# EAGLE design AlvDuino (EAGLE 6.3)
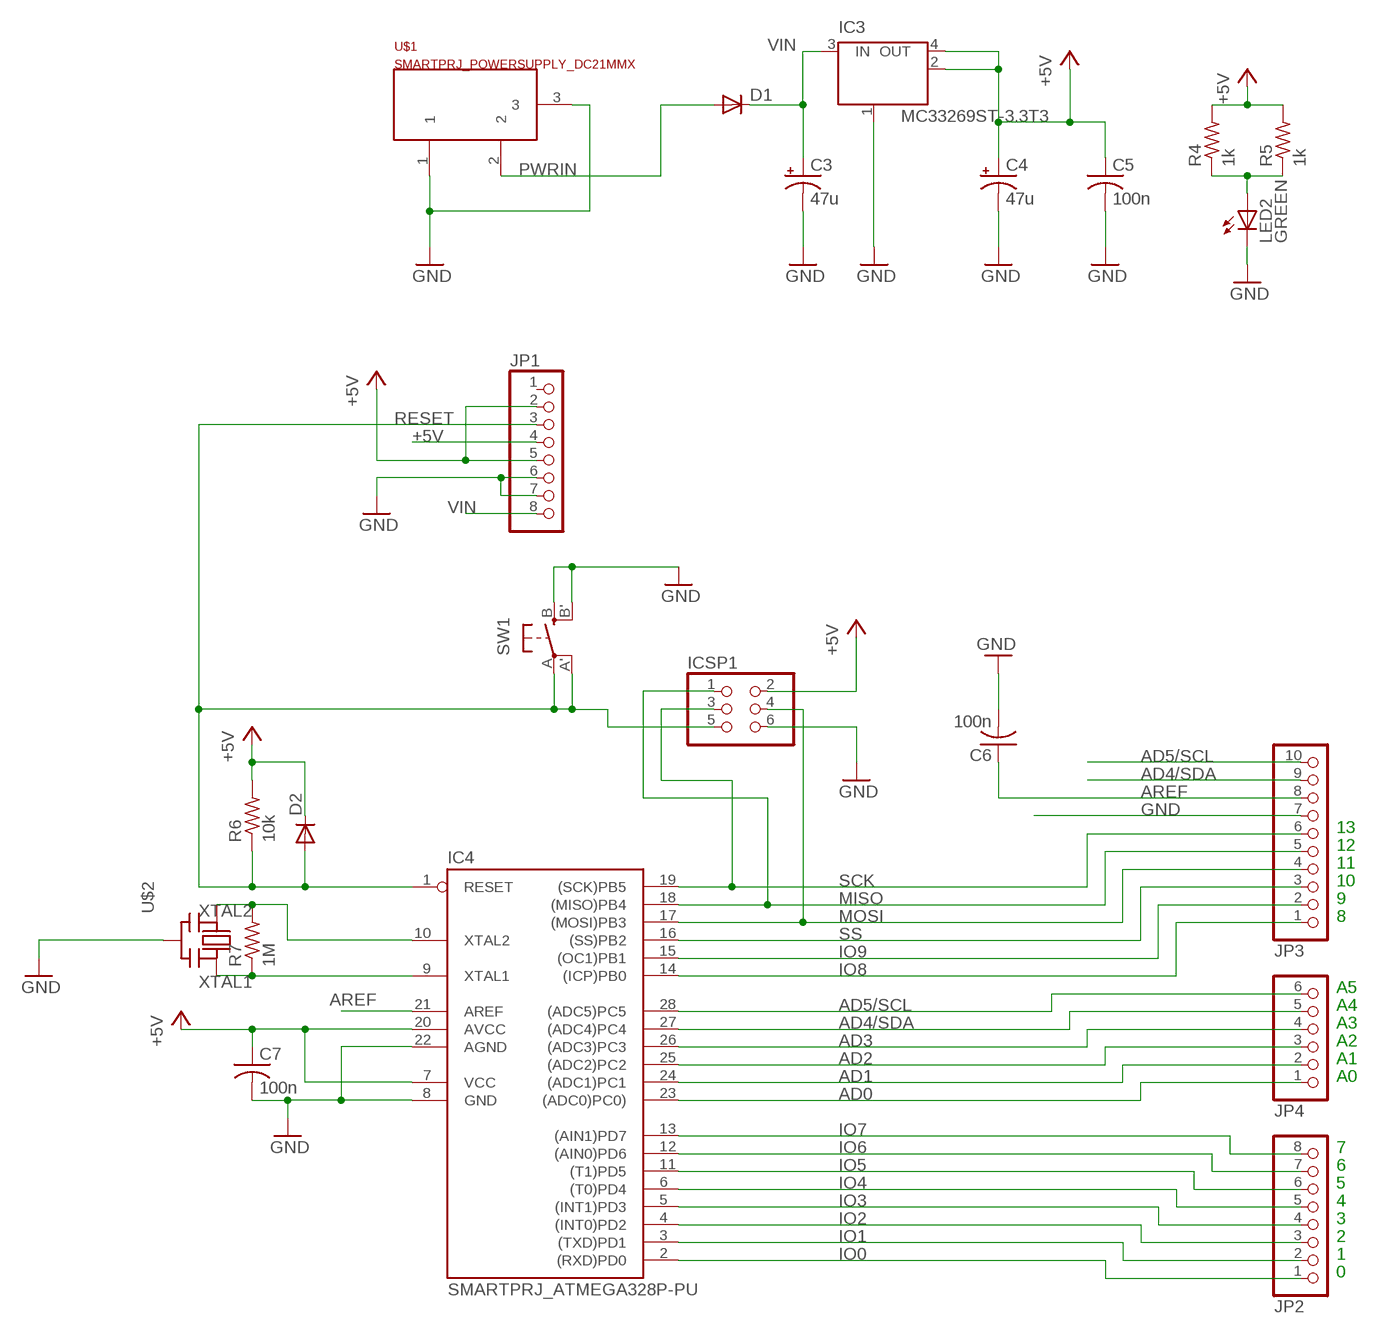
[diagram p0: schematic, sheet 1]

## Parts
C3  47u  CPOL-USD  [PANASONIC_D]
C4  47u  CPOL-USD  [PANASONIC_D]
C5  100n  C-USC1206  [C1206]
C6  100n  C-USC1206  [C1206]
C7  100n  C-USC1206  [C1206]
D1  DIODE-DO214AA  [DO214AA]
D2  DIODE-DO214AA  [DO214AA]
IC3  MC33269ST-3.3T3  [SOT223]
IC4  SMARTPRJ_ATMEGA328P-PU  [SMARTPRJ_DIL28-3]
ICSP1  PINHD-2X3  [2X03]
JP1  PINHD-1X8  [1X08]
JP2  PINHD-1X8  [1X08]
JP3  PINHD-1X10  [1X10]
JP4  PINHD-1X6  [1X06]
LED2  GREEN  LEDCHIPLED_1206  [CHIPLED_1206]
R4  1k  R-US_R1206  [R1206]
R5  1k  R-US_R1206  [R1206]
R6  10k  R-US_R1206  [R1206]
R7  1M  R-US_R1206  [R1206]
SW1  SPST_TACT-EVQQ2  [EVQ-Q2]
U$1  SMARTPRJ_POWERSUPPLY_DC21MMX  [SMARTPRJ_POWERSUPPLY_DC-21MM]
U$2  CERMOSCILL-THM  [CERM_OSC]

## Nets
+5V [usbvcc]: C4.+ C5.1 C7.1 D2.C IC3.2(OUT) IC3.4(OUT) IC4.7(VCC) IC4.20(AVCC) ICSP1.2 JP1.2 JP1.4 JP1.5 R4.2 R5.2 R6.2
AD0: IC4.23((ADC0)PC0)) JP4.1
AD1: IC4.24((ADC1)PC1) JP4.2
AD2: IC4.25((ADC2)PC2) JP4.3
AD3: IC4.26((ADC3)PC3) JP4.4
AD4/SDA: IC4.27((ADC4)PC4) JP3.9 JP4.5
AD5/SCL: IC4.28((ADC5)PC5) JP3.10 JP4.6
AREF: C6.1 IC4.21(AREF) JP3.8
GND [gnd]: C3.- C4.- C5.2 C6.2 C7.2 IC3.1(GND/ADJ) IC4.8(GND) IC4.22(AGND) ICSP1.6 JP1.6 JP1.7 JP3.7 LED2.C SW1.B'(S1) SW1.B(S) U$1.1 U$1.3 U$2.P$2(GND)
IO0: IC4.2((RXD)PD0) JP2.1
IO1: IC4.3((TXD)PD1) JP2.2
IO2: IC4.4((INT0)PD2) JP2.3
IO3: IC4.5((INT1)PD3) JP2.4
IO4: IC4.6((T0)PD4) JP2.5
IO5: IC4.11((T1)PD5) JP2.6
IO6: IC4.12((AIN0)PD6) JP2.7
IO7: IC4.13((AIN1)PD7) JP2.8
IO8: IC4.14((ICP)PB0) JP3.1
IO9: IC4.15((OC1)PB1) JP3.2
MISO: IC4.18((MISO)PB4) ICSP1.1 JP3.5
MOSI: IC4.17((MOSI)PB3) ICSP1.4 JP3.4
N$3: LED2.A R4.1 R5.1
PWRIN [power]: D1.A U$1.2
RESET: D2.A IC4.1(RESET) ICSP1.5 JP1.3 R6.1 SW1.A'(P1) SW1.A(P)
SCK: IC4.19((SCK)PB5) ICSP1.3 JP3.6
SS: IC4.16((SS)PB2) JP3.3
VIN [power]: C3.+ D1.C IC3.3(IN) JP1.8
XTAL1: IC4.9(XTAL1) R7.1 U$2.P$3(OUT)
XTAL2: IC4.10(XTAL2) R7.2 U$2.P$1(IN)
Unconnected: JP1.1

## Notes on the sheet
- 13
- 12
- 11
- 10
- 9
- 8
- A5
- A4
- A3
- A2
- A1
- A0
- 7
- 6
- 5
- 4
- 3
- 2
- 1
- 0

## Library data of the parts
C3 C4 = rcl:CPOL-US: POLARIZED CAPACITOR, American symbol
C5-C7 = adafruit:C-US: CAPACITOR, American symbol
D1 D2 = diode:DIODE-: DIODE
IC3 = linear:MC33269ST*: Adjustable Output Low Dropout Voltage Regulator 800 mA Source: http://www.onsemi.com/pub/Collateral/MC33269-D.PDF
IC4 = arduino_Uno_Rev3-02-TH:SMARTPRJ_ATMEGA328P-: MICROCONTROLLER 4 Kbytes FLASH 128 bytes SRAM 256 bytes EEPROM UART 6-channel 10 bit ADC
ICSP1 = pinhead:PINHD-2X3: PIN HEADER
JP1 JP2 = pinhead:PINHD-1X8: PIN HEADER
JP3 = pinhead:PINHD-1X10: PIN HEADER
JP4 = pinhead:PINHD-1X6: PIN HEADER
LED2 = led:LED: LED OSRAM: - CHIPLED LG R971, LG N971, LY N971, LG Q971, LY Q971, LO R971, LY R971 LH N974, LH R974 LS Q976, LO Q976, LY Q976 LO Q996 - Hyper CHIPLED LW Q18S LB Q993, LB Q99A, LB R99A - SideLED LS A670, LO A670, LY A670, LG A670, LP A670 LB A673, LV A673, LT A673, LW A673 LH A674 LY A675 LS A676, LA A676, LO A676, LY A676, LW A676 LS A679, LY A679, LG A679 - Hyper Micro SIDELED® LS Y876, LA Y876, LO Y876, LY Y876 LT Y87S - SmartLED LW L88C, LW L88S LB L89C, LB L89S, LG L890 LS L89K, LO L89K, LY L89K LS L896, LA L896, LO L896, LY L896 - TOPLED LS T670, LO T670, LY T670, LG T670, LP T670 LSG T670, LSP T670, LSY T670, LOP T670, LYG T670 LG T671, LOG T671, LSG T671 LB T673, LV T673, LT T673, LW T673 LH T674 LS T676, LA T676, LO T676, LY T676, LB T676, LH T676, LSB T676, LW T676 LB T67C, LV T67C, LT T67C, LS T67K, LO T67K, LY T67K, LW E67C LS E67B, LA E67B, LO E67B, LY E67B, LB E67C, LV E67C, LT E67C LW T67C LS T679, LY T679, LG T679 LS T770, LO T770, LY T770, LG T770, LP T770 LB T773, LV T773, LT T773, LW T773 LH T774 LS E675, LA E675, LY E675, LS T675 LS T776, LA T776, LO T776, LY T776, LB T776 LHGB T686 LT T68C, LB T68C - Hyper Mini TOPLED® LB M676 - Mini TOPLED Santana® LG M470 LS M47K, LO M47K, LY M47K Source: http://www.osram.convergy.de LUXEON: - LUMILED® LXK2-PW12-R00, LXK2-PW12-S00, LXK2-PW14-U00, LXK2-PW14-V00 LXK2-PM12-R00, LXK2-PM12-S00, LXK2-PM14-U00 LXK2-PE12-Q00, LXK2-PE12-R00, LXK2-PE12-S00, LXK2-PE14-T00, LXK2-PE14-U00 LXK2-PB12-K00, LXK2-PB12-L00, LXK2-PB12-M00, LXK2-PB14-N00, LXK2-PB14-P00, LXK2-PB14-Q00 LXK2-PR12-L00, LXK2-PR12-M00, LXK2-PR14-Q00, LXK2-PR14-R00 LXK2-PD12-Q00, LXK2-PD12-R00, LXK2-PD12-S00 LXK2-PH12-R00, LXK2-PH12-S00 LXK2-PL12-P00, LXK2-PL12-Q00, LXK2-PL12-R00 Source: www.luxeon.com KINGBRIGHT: KA-3528ASYC Source: www.kingbright.com
R4-R7 = adafruit:R-US_: RESISTOR, American symbol
SW1 = adafruit:SPST_TACT: SMT 6mm switch, EVQQ2 series http://www.ladyada.net/library/eagle
U$1 = arduino_Uno_Rev3-02-TH:SMARTPRJ_POWERSUPPLY_DC21MM
U$2 = adafruit:CERMOSCILL: Ceramic oscillator with built in capacitors such as ZTT-12MHz http://www.ladyada.net/library/eagle

## Net classes
0 default: width 0.254 mm, clearance 0.254 mm
1 power: width 0.61 mm, drill 0.61 mm, clearance 0.254 mm
2 gnd: width 0.305 mm, drill 0.559 mm, clearance 0.254 mm
3 usbvcc: width 0.508 mm, drill 0.61 mm, clearance 0.254 mm
4 aref: width 0.406 mm, drill 0.61 mm, clearance 0.254 mm

## Board
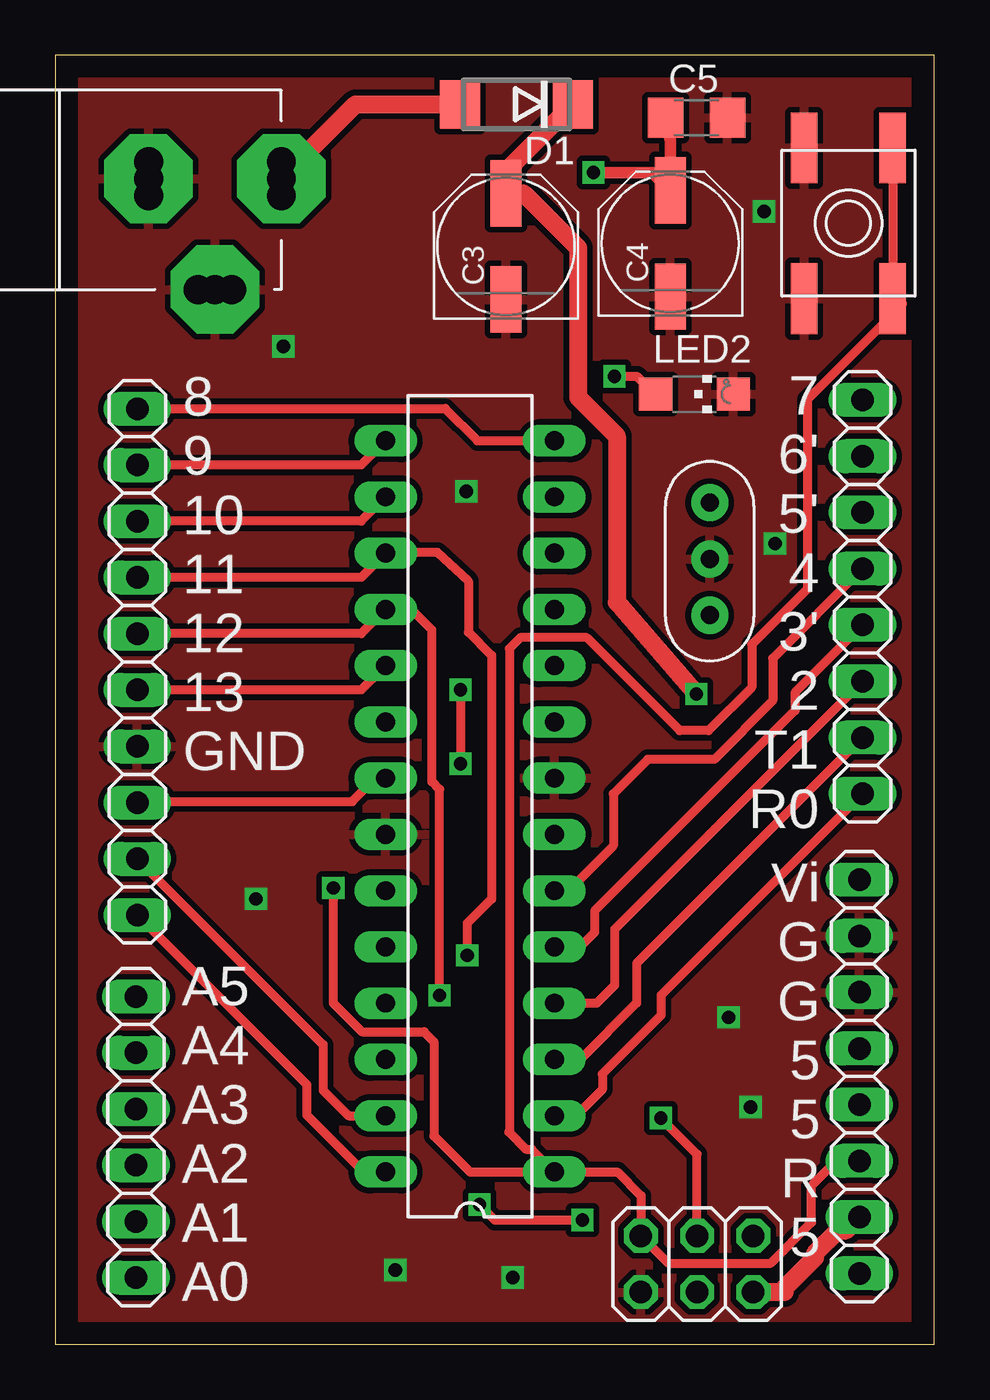
[diagram p1: board, top side]
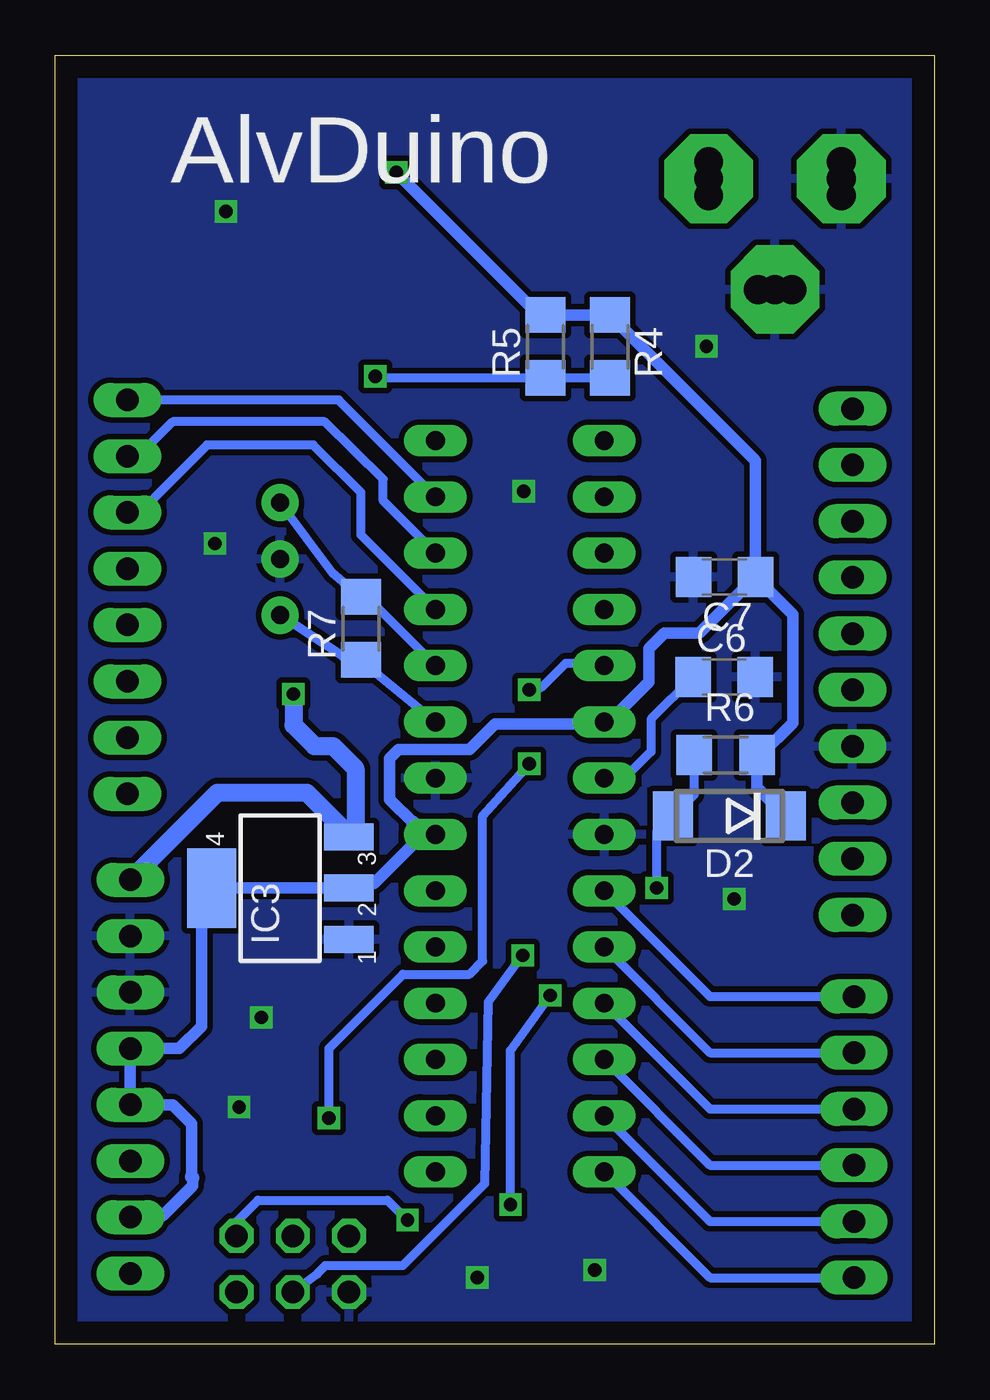
[diagram p2: board, bottom side, seen from below]

Size 39.7 x 58.19 mm. Coordinates in mm from the lower left corner, seen from the top.
Outline: 0,0 39.7,0 39.7,58.19 0,58.19 0,0
Copper layers (1*16): Top 0.035mm / dielectric 1.5mm / Bottom 0.035mm
Design rules "default": minimum track width 10mil, minimum drill 24mil, track to track 8mil, track to pad 8mil, pad to pad 8mil, via to via 8mil, smd to smd 8mil, copper to edge 40mil, drill to drill 8mil, minimum pad ring 10mil, minimum via ring 8mil, stop-mask expansion 4mil, vias tented up to drill 0mil, thermal gap 10mil

### Footprints (pad centres in the part's own frame; a part is rotated, then mirrored left to right if it is on the bottom)
PANASONIC_D = smd 3 x 1.4: + 2.4,0; - -2.4,0
C1206 = smd 1.6 x 1.8: 1 -1.4,0; 2 1.4,0
DO214AA = smd 1.8 x 2.2: A 2.55,0; C -2.55,0
SOT223 = smd 1.219 x 2.235: 1 -2.311,-3.099; 2 0,-3.099; 3 2.311,-3.099 | smd 3.6 x 2.2: 4 0,3.099
SMARTPRJ_DIL28-3 = drill 0.85 pad 1.422 long: 1 -16.51,-3.81; 2 -13.97,-3.81; 3 -11.43,-3.81; 4 -8.89,-3.81; 5 -6.35,-3.81; 6 -3.81,-3.81; 7 -1.27,-3.81; 8 1.27,-3.81; 9 3.81,-3.81; 10 6.35,-3.81; 11 8.89,-3.81; 12 11.43,-3.81; 13 13.97,-3.81; 14 16.51,-3.81; 15 16.51,3.81; 16 13.97,3.81; 17 11.43,3.81; 18 8.89,3.81; 19 6.35,3.81; 20 3.81,3.81; 21 1.27,3.81; 22 -1.27,3.81; 23 -3.81,3.81; 24 -6.35,3.81; 25 -8.89,3.81; 26 -11.43,3.81; 27 -13.97,3.81; 28 -16.51,3.81
2X03 = drill 1.016 octagon: 1 -2.54,-1.27; 2 -2.54,1.27; 3 0,-1.27; 4 0,1.27; 5 2.54,-1.27; 6 2.54,1.27
1X08 = drill 1.016 long: 1 -8.89,0; 2 -6.35,0; 3 -3.81,0; 4 -1.27,0; 5 1.27,0; 6 3.81,0; 7 6.35,0; 8 8.89,0
1X10 = drill 1.016 long: 1 -11.43,0; 2 -8.89,0; 3 -6.35,0; 4 -3.81,0; 5 -1.27,0; 6 1.27,0; 7 3.81,0; 8 6.35,0; 9 8.89,0; 10 11.43,0
1X06 = drill 1.016 long: 1 -6.35,0; 2 -3.81,0; 3 -1.27,0; 4 1.27,0; 5 3.81,0; 6 6.35,0
CHIPLED_1206 = smd 1.5 x 1.5: A 0,-1.75; C 0,1.75
R1206 = smd 1.6 x 1.803: 1 -1.422,0; 2 1.422,0
EVQ-Q2 = smd 3.2 x 1.2: A -3.4,-2; A' 3.4,-2; B -3.4,2; B' 3.4,2
SMARTPRJ_POWERSUPPLY_DC-21MM = drill 1.3 pad 4 octagon: 1 -5.08,-3.353; 2 -0.076,-6.35; 3 -0.076,-0.356 | drill 1.3: 4 -5.08,-4.115; 5 -5.08,-2.591; 6 -0.838,-0.356; 7 0.686,-0.356; 8 -0.838,-6.35; 9 0.686,-6.35
CERM_OSC = drill 0.813 pad 1.676: P$1 -2.54,0; P$2 0,0; P$3 2.54,0

### Placement (x,y rotation side)
C3  20.35,49.56 90 top
C4  27.77,49.7 90 top
C5  28.95,55.38 0 top
C6  9.49,30.12 0 bottom
C7  9.48,34.63 180 bottom
D1  20.83,55.98 180 top
D2  9.26,23.85 180 bottom
IC3  29.55,20.59 90 bottom
IC4  18.72,24.28 90 top
ICSP1  28.98,3.62 180 top
JP1  36.31,12.08 90 top
JP2  36.45,33.74 90 top
JP3  3.7,30.81 270 top
JP4  3.64,9.35 270 top
LED2  28.86,42.89 270 top
R4  14.65,45.04 90 bottom
R5  17.58,45.04 90 bottom
R6  9.43,26.6 0 bottom
R7  25.9,32.31 90 bottom
SW1  35.81,50.61 90 top
U$1  3.85,52.7 90 top
U$2  29.55,35.45 270 top

### Tracks (layer width: path | path; a pad name or v marks a point on that pad's centre or on a via)
+5V  (via drill 0.6)
  Top 0.508: C5.1 27.77,54.34 C4.+ 26.96,52.9 v24.3,52.9 | 32.93,2.35 32.93,2.53 | 34.3,3.9 34.3,4.1
  Top 0.813: 32.93,2.35 ICSP1.2 | 32.93,2.53 34.3,3.9 | 34.3,4.1 35.35,5.15 35.73,5.15 JP1.2
  Bottom 0.508: D2.C 8.01,25.14 R6.2 7.85,26.6 6.4,28.05 6.4,32.95 C7.1 | C7.1 10.62,32.1 12.2,32.1 12.9,31.4 12.9,29.9 14.71,28.09 IC4.20 15.01,28 19.85,28 21,26.85 24.2,26.85 24.6,26.45 24.6,24.6 23.55,23.55 | v24.3,52.9 17.86,46.46 R5.2 R4.2 8.08,39.9 C7.1 | 33.55,7.55 33.55,9.95 34.41,10.81 JP1.4 JP1.5 34.1,13.35 33.1,14.35 33.1,20.14 IC3.4 IC3.2 26.24,20.8 25.3,20.8 23.09,23.01 IC4.7 | 33.5,7.5 33.5,7.15 34.85,5.8 36.24,5.8
  Bottom 0.61: 33.55,7.55 33.5,7.5 | 36.24,5.8 JP1.2 | 23.55,23.55 23.55,23.48 23.09,23.01
AD0
  Bottom 0.406: IC4.23 10.14,15.7 JP4.1
AD1
  Bottom 0.406: IC4.24 10.14,13.16 JP4.2
AD2
  Bottom 0.406: IC4.25 10.14,10.62 JP4.3
AD3
  Bottom 0.406: IC4.26 10.14,8.08 JP4.4
AD4/SDA
  Top 0.406: JP3.9 12.1,13.52 12.1,11.45 13.24,10.31 IC4.27
  Bottom 0.406: IC4.27 10.14,5.54 JP4.5
AD5/SCL
  Top 0.406: JP3.10 11.35,11.73 11.35,10.35 13.93,7.77 IC4.28
  Bottom 0.406: IC4.28 10.14,3 JP4.6
AREF
  Top 0.406: JP3.8 3.74,24.5 13.4,24.5 14.45,25.55 IC4.21
  Bottom 0.406: C6.1 12.8,28.22 12.8,26.75 14,25.55 IC4.21
GND  (via drill 0.6)
  other vias: 10.3,45.05 18.55,38.5 9.05,20.1 15.35,3.35 20.65,3 31.4,10.7 30.4,14.75 32.5,36.15 32,51.15
  pour Bottom: -11.95,61.02 -15.5,61.02 -15.5,-4.51 77.72,-4.51 77.72,59.5 -11.95,59.5
  pour Top: -11.95,61.02 -15.5,61.02 -15.5,-4.25 77.72,-4.25 77.72,59.5 -11.95,59.5
IO0
  Top 0.406: JP2.1 27.35,15.75 27.35,14.85 24.7,12.2 24.7,11.5 23.51,10.31 IC4.2
IO1
  Top 0.406: JP2.2 26.25,17.19 26.25,15.4 23.7,12.85 IC4.3
IO2
  Top 0.406: JP2.3 25.25,18.73 25.25,16.2 24.44,15.39 IC4.4
IO3
  Top 0.406: JP2.4 33.4,29.42 33.4,28.6 24.35,19.55 24.35,18.6 23.68,17.93 IC4.5
IO4
  Top 0.406: JP2.5 32.4,30.96 32.4,29.05 29.75,26.4 26.75,26.4 25.2,24.85 25.2,22.5 23.17,20.47 IC4.6
IO5
  Bottom 0.406: IC4.11 25.9,36.54 25.9,38.45 28.05,40.6 32.85,40.6 35.9,37.55 JP2.6
IO6
  Bottom 0.406: IC4.12 24.9,38.08 24.9,39.05 27.55,41.65 34.4,41.65 35.96,40.09 JP2.7
IO7
  Bottom 0.406: IC4.13 26.91,42.63 JP2.8
IO8
  Top 0.406: JP3.1 3.71,42.25 17.6,42.25 19.06,40.79 IC4.14
IO9
  Top 0.406: IC4.15 13.82,39.7 JP3.2
MISO  (via drill 0.6)
  Top 0.406: JP3.5 13.82,32.08 IC4.18 14.99,33.25 16,33.25 17,32.25 17,25.4 17.35,25.05 v17.35,15.75 | v23.8,5.6 19.85,5.6 v19.15,6.3
  Bottom 0.406: ICSP1.1 31.52,5.53 30.55,6.5 24.7,6.5 v23.8,5.6 | v19.15,6.3 19.15,13.25 v17.35,15.75
MOSI  (via drill 0.6)
  Top 0.406: JP3.4 13.82,34.62 IC4.17 14.95,35.75 17.25,35.75 18.65,34.45 18.65,32.15 19.7,31.1 19.7,20.1 18.6,19 v18.6,17.55
  Bottom 0.406: ICSP1.4 27.88,3.17 27.5,3.55 24,3.55 20.3,7.25 20.15,15.45 v18.6,17.55
N$3  (via drill 0.6)
  Top 0.406: v25.25,43.7 26.26,43.7 LED2.A
  Bottom 0.406: R4.1 R5.1 24.87,43.62 v25.25,43.7
PWRIN
  Top 0.813: U$1.2 13.56,55.98 D1.A
RESET  (via drill 0.6)
  Top 0.406: v12.55,20.6 12.55,15.4 13.85,14.1 16.65,14.1 17.1,13.65 17.1,9.4 18.73,7.77 IC4.1 | ICSP1.5 27.68,3.65 32.3,3.65 34.15,5.5 34.15,7.15 35.27,8.27 JP1.3 | SW1.A' SW1.A 38.26,46.96 33.95,42.65 33.95,34.1 31.45,31.6 31.45,29.65 29.5,27.7 28.2,27.7 24,31.9 21,31.9 20.5,31.4 20.5,9.6 20.48,9.57 21.25,8.8 21.51,8.8 IC4.1 | ICSP1.5 26.39,4.92 | IC4.1 25.38,7.77 26.45,6.7 ICSP1.5
  Bottom 0.406: v12.55,20.6 12.55,23.11 D2.A 10.86,24.8 R6.1
SCK  (via drill 0.6)
  Top 0.406: IC4.19 13.82,29.54 JP3.6 | ICSP1.3 28.98,8.57 v27.35,10.2 | v18.3,29.55 v18.3,26.2
  Bottom 0.406: v27.35,10.2 27.35,13.35 24,16.7 21,16.7 20.4,17.3 20.4,23.85 v18.3,26.2 | v18.3,29.55 17.75,29.65 16.65,30.75 15.03,30.75 IC4.19
SS
  Top 0.406: IC4.16 13.82,37.16 JP3.3
VIN  (via drill 0.6)
  Top 0.61: 20.35,52.95 C3.+ 21.14,51.96
  Top 0.813: D1.C 20.35,52.95 | 21.14,51.96 23.6,49.5 23.6,42.75 25.35,41 25.35,33.5 v28.95,29.35
  Bottom 0.61: 26.45,23 IC3.3
  Bottom 0.813: JP1.8 32.38,24.9 28.35,24.9 26.45,23 | v28.95,29.35 28.95,27.95 28,27 27.15,27 26.15,26 26.15,23.2 IC3.3
XTAL1
  Bottom 0.406: IC4.9 25.53,30.54 R7.1 26.73,31.06 U$2.P$3
XTAL2
  Bottom 0.406: IC4.10 25.09,33.19 R7.2 27.16,34.79 U$2.P$1

### Text on the board
tNames: 8 / 9 / 10 / 11 / 12 / 13 / GND | 7 / 6' / 5' / 4 / 3' / 2 / T1 / R0 | Vi / G / G / 5 / 5 / R / 5 | A5 / A4 / A3 / A2 / A1 / A0
bNames: AlvDuino